# EAGLE design Home_automation (EAGLE 9.6.2)
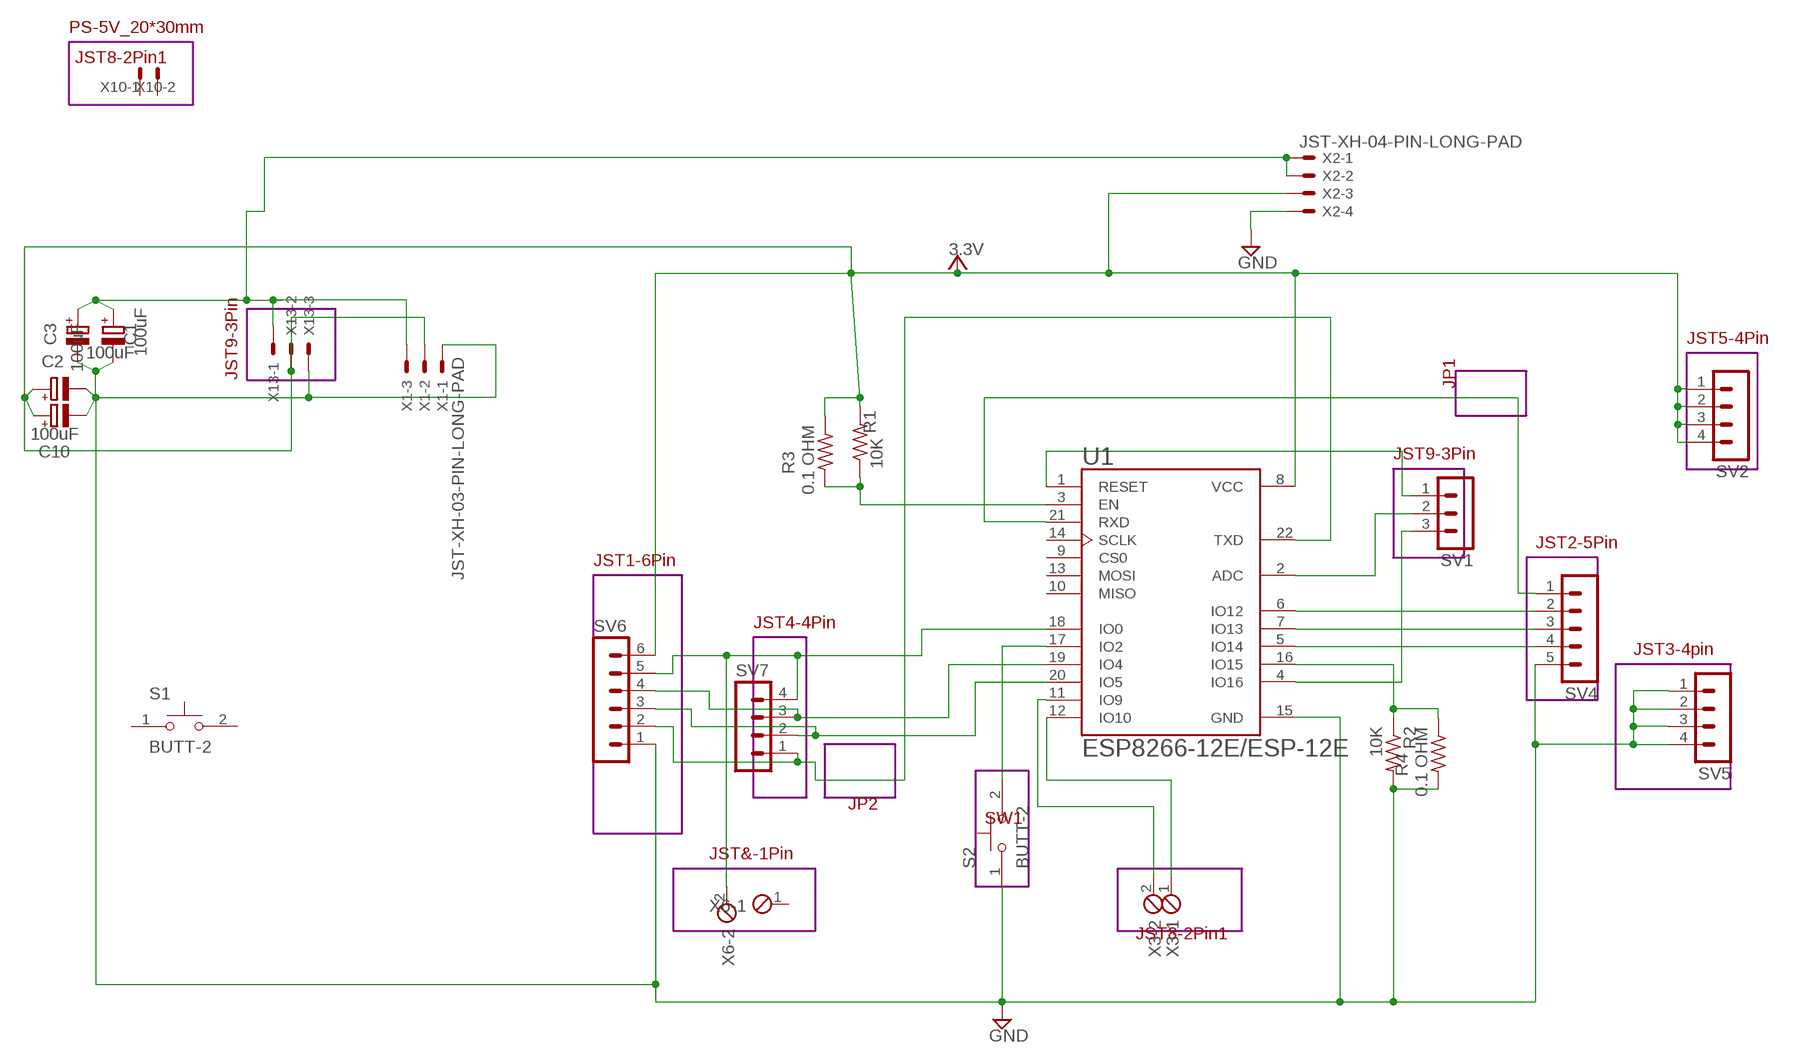
[diagram p0: schematic, sheet 1]

## Parts
C1  100uF  CPOL-EUSMCB  [SMC_B]
C2  100uF  CPOL-EUE2,5-6E  [E2,5-6E]
C3  100uF  CPOL-EUE2,5-6E  [E2,5-6E]
C10  100uF  CPOL-EUSMCB  [SMC_B]
R1  10K  R-US_R0805  [R0805]
R2  10K  R-US_R0805  [R0805]
R3  0.1 OHM  R-US_0207/10  [0207/10]
R4  0.1 OHM  R-US_0207/10  [0207/10]
S1  BUTT-2  [SW_BUTT-2]
S2  BUTT-2  [SW_BUTT-2]
SV1  MA03-1  [MA03-1]
SV2  MA04-1  [MA04-1]
SV4  MA05-1  [MA05-1]
SV5  MA04-1  [MA04-1]
SV6  MA06-1  [MA06-1]
SV7  MA04-1  [MA04-1]
U1  ESP8266-12E/ESP-12E  [XCVR_ESP8266-12E/ESP-12E]
X1  JST-XH-03-PIN-LONG-PAD  [JST-XH-03-PACKAGE-LONG-PAD]
X2  JST-XH-04-PIN-LONG-PAD  [JST-XH-04-PACKAGE-LONG-PAD]
X3  MPT2  [2POL254]
X6  MPT2  [2POL254]
X10  JST-XH-02-PIN-LONG-PAD  [JST-XH-02-PACKAGE-LONG-PAD]
X13  JST9-3Pin  JST-XH-03-PIN-LONG-PAD  [JST-XH-03-PACKAGE-LONG-PAD]

## Nets
GND: C1.- C2.- C3.- C10.- R2.2 R4.2 S2.1 SV4.5 SV5.1 SV5.2 SV5.3 SV5.4 SV6.1 U1.15(GND) X1.1 X2.4 X13.3
N$1: SV4.3 U1.7(IO13)
N$2: SV4.2 U1.6(IO12)
N$3: SV4.4 U1.5(IO14)
N$4: SV4.1 U1.21(RXD)
N$7: R1.1 R3.2 U1.3(EN)
N$9: SV6.2 SV7.1 U1.22(TXD)
N$10: C1.+ C3.+ X1.3 X2.1 X2.2 X13.1
N$11: SV6.3 SV7.2 U1.20(IO5)
N$12: SV6.4 SV7.3 U1.19(IO4)
N$13: SV6.5 SV7.4 U1.18(IO0) X6.2
N$14: R2.1 R4.1 U1.16(IO15)
N$15: S2.2 U1.17(IO2)
N$16: U1.12(IO10) X3.1
N$17: U1.11(IO9) X3.2
N$18: SV1.1 U1.1(RESET)
N$19: SV1.2 U1.2(ADC)
N$20: SV1.3 U1.4(IO16)
VCC: C2.+ C10.+ R1.2 R3.1 SV2.1 SV2.2 SV2.3 SV2.4 SV6.6 U1.8(VCC) X1.2 X2.3 X13.2 ; supply symbol labelled 3.3V
Unconnected: S1.1 S1.2 U1.9(CS0) U1.10(MISO) U1.13(MOSI) U1.14(SCLK) X6.1 X10.1 X10.2

## Notes on the sheet
- PS-5V_20*30mm
- JST8-2Pin1
- JST5-4Pin
- JST9-3Pin
- JP1
- JST9-3Pin
- JST2-5Pin
- JST1-6Pin
- JST4-4Pin
- JST3-4pin
- JP2
- SW1
- JST&-1Pin
- JST8-2Pin1

## Library data of the parts
C1-C3 C10 = rcl:CPOL-EU: POLARIZED CAPACITOR, European symbol; SPICEPREFIX: C
R1-R4 = rcl:R-US_: RESISTOR, American symbol; SPICEPREFIX: R
S1 = BUTT-2_:BUTT-2: Tactile Switches MINI PUSH BUTTON SWITCH 2-PIN QTY. 4 Check prices <https://pricing.snapeda.com/parts/BUTT-2/Gravitech/view-part?ref=eda>; AVAILABILITY: Warning; DESCRIPTION: Tactile Switches MINI PUSH BUTTON SWITCH 2-PIN QTY. 4; MF: Gravitech; MP: BUTT-2; PACKAGE: None; PRICE: None; PURCHASE-URL: https://pricing.snapeda.com/search/part/BUTT-2/?ref=eda
S2 = BUTT-2:BUTT-2: Tactile Switches MINI PUSH BUTTON SWITCH 2-PIN QTY. 4 Check prices <https://pricing.snapeda.com/parts/BUTT-2/Gravitech/view-part?ref=eda>; AVAILABILITY: Warning; DESCRIPTION: Tactile Switches MINI PUSH BUTTON SWITCH 2-PIN QTY. 4; MF: Gravitech; MP: BUTT-2; PACKAGE: None; PRICE: None; PURCHASE-URL: https://pricing.snapeda.com/search/part/BUTT-2/?ref=eda
SV1 = con-lstb:MA03-1: PIN HEADER; OC_FARNELL: unknown; OC_NEWARK: unknown
SV2 SV5 SV7 = con-lstb:MA04-1: PIN HEADER; OC_FARNELL: unknown; OC_NEWARK: unknown
SV4 = con-lstb:MA05-1: PIN HEADER; OC_FARNELL: unknown; OC_NEWARK: unknown
SV6 = con-lstb:MA06-1: PIN HEADER; OC_FARNELL: unknown; OC_NEWARK: unknown
U1 = ESP8266-12E_ESP-12E:ESP8266-12E/ESP-12E: ESP-12E WiFi Module; AVAILABILITY: Unavailable; DESCRIPTION: This WiFi module has a 32-bit MCU micro and clock speeds supporting 80 MHz or 160 MHz. Supports the RTOS and integrated Wi-Fi MAC/BB/RF/PA/LNA, and has an on-board antenna.; MF: AI-Thinker; MP: ESP8266-12E/ESP-12E; PACKAGE: None; PRICE: None
X1 X13 = Rembrandt Electronics - JST XH Connectors v1-0:JST-XH-03-PIN: JST XH Connector 2 Pin Wire to board connector. Pitch: 2,54 mm, (0.100") Number of pins: 3 Created by Rembrandt Electronics www.rembrandtelectronics.com
X2 = Rembrandt Electronics - JST XH Connectors v1-0:JST-XH-04-PIN: JST XH Connector 2 Pin Wire to board connector. Pitch: 2,54 mm, (0.100") Number of pins: 4 Created by Rembrandt Electronics www.rembrandtelectronics.com
X3 X6 = con-phoenix-254:MPT2: PHOENIX CONNECTOR; OC_FARNELL: unknown; OC_NEWARK: unknown
X10 = Rembrandt Electronics - JST XH Connectors v1-0:JST-XH-02-PIN: JST XH Connector 2 Pin Wire to board connector. Pitch: 2,54 mm, (0.100") Number of pins: 2 Created by Rembrandt Electronics www.rembrandtelectronics.com

## Board
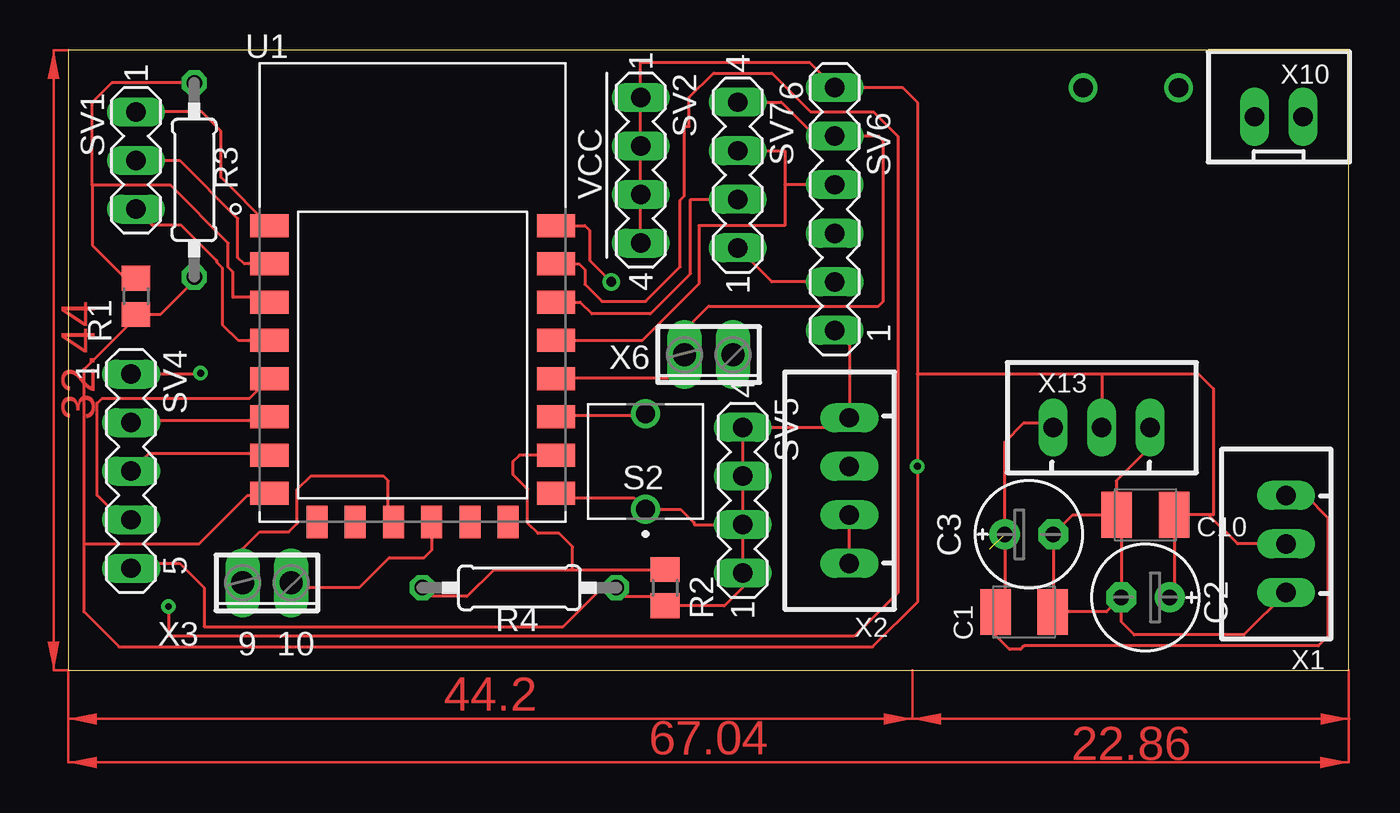
[diagram p1: board, top side]
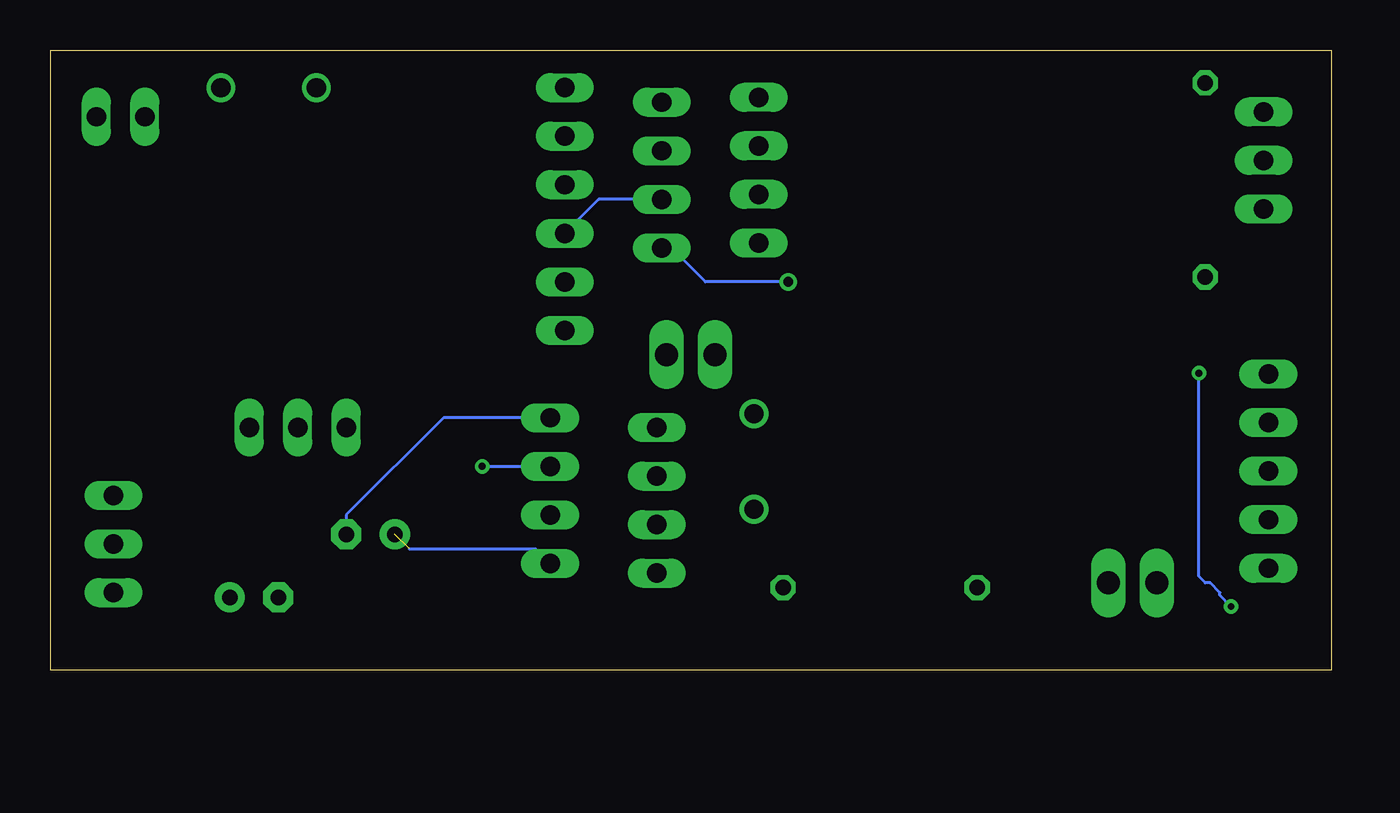
[diagram p2: board, bottom side, seen from below]

Size 67.04 x 32.44 mm. Coordinates in mm from the lower left corner, seen from the top.
Outline: 0,0 67.04,0 67.04,32.44 0,32.44 0,0
Copper layers (1*16): Top 0.035mm / dielectric 1.5mm / Bottom 0.035mm
Design rules "default": minimum track width 6mil, minimum drill 0.35mm, track to track 6mil, track to pad 6mil, pad to pad 6mil, via to via 6mil, smd to smd 6mil, copper to edge 40mil, drill to drill 6mil, minimum pad ring 10mil, minimum via ring 8mil, stop-mask expansion 4mil, vias tented up to drill 0mil, thermal gap 10mil

### Footprints (pad centres in the part's own frame; a part is rotated, then mirrored left to right if it is on the bottom)
SMC_B = smd 1.6 x 2.4: + -1.5,0; - 1.5,0
E2,5-6E = drill 0.813 pad 1.575: + -1.27,0 | drill 0.813 pad 1.575 octagon: - 1.27,0
R0805 = smd 1.3 x 1.5: 1 -0.95,0; 2 0.95,0
0207/10 = drill 0.813 octagon: 1 -5.08,0; 2 5.08,0
SW_BUTT-2 = drill 1: 1 -2.5,0; 2 2.5,0
MA03-1 = drill 1.016 long: 1 -2.54,0; 2 0,0; 3 2.54,0
MA04-1 = drill 1.016 long: 1 -3.81,0; 2 -1.27,0; 3 1.27,0; 4 3.81,0
MA05-1 = drill 1.016 long: 1 -5.08,0; 2 -2.54,0; 3 0,0; 4 2.54,0; 5 5.08,0
MA06-1 = drill 1.016 long: 1 -6.35,0; 2 -3.81,0; 3 -1.27,0; 4 1.27,0; 5 3.81,0; 6 6.35,0
XCVR_ESP8266-12E/ESP-12E = smd 2 x 1.2: 1 -7.5,7; 2 -7.5,5; 3 -7.5,3; 4 -7.5,1; 5 -7.5,-1; 6 -7.5,-3; 7 -7.5,-5; 8 -7.5,-7; 15 7.5,-7; 16 7.5,-5; 17 7.5,-3; 18 7.5,-1; 19 7.5,1; 20 7.5,3; 21 7.5,5; 22 7.5,7 | smd 1.1 x 1.7: 9 -5,-8.5; 10 -3,-8.5; 11 -1,-8.5; 12 1,-8.5; 13 3,-8.5; 14 5,-8.5
JST-XH-03-PACKAGE-LONG-PAD = drill 1.016 long: 1 -2.54,0; 2 0,0; 3 2.54,0
JST-XH-04-PACKAGE-LONG-PAD = drill 1.016 long: 1 -3.81,0; 2 -1.27,0; 3 1.27,0; 4 3.81,0
2POL254 = drill 1.2 long: 1 -1.27,0; 2 1.27,0
JST-XH-02-PACKAGE-LONG-PAD = drill 1.016 long: 1 -1.27,0; 2 1.27,0

### Placement (x,y rotation side)
C1  50.04,3.05 0 top
C2  56.39,3.81 180 top
C3  50.29,7.11 0 top
C10  56.39,8.13 180 top
R1  3.56,19.56 270 top
R2  31.24,4.32 270 top
R3  6.6,25.65 90 top
R4  23.62,4.32 0 top
S1  55.63,30.48 0 top
S2  30.23,10.92 90 top
SV1  3.56,26.67 270 top
SV2  29.97,26.16 270 top
SV4  3.3,10.41 270 top
SV5  35.31,8.89 90 top
SV6  40.13,24.13 90 top
SV7  35.05,25.91 90 top
U1  18.03,16.26 0 top
X1  63.75,6.6 90 top
X2  40.89,9.4 90 top
X3  10.41,4.57 180 top
X6  33.53,16.51 180 top
X10  63.37,28.96 0 top
X13  54.1,12.7 0 top

### Tracks (layer width: path | path; a pad name or v marks a point on that pad's centre or on a via)
GND
  Top 0.152: R2.2 31.24,3.86 29.16,3.86 R4.2 | 25.6,9.2 U1.15 25.79,9 29.65,9 S2.1 | 28.6,4.37 R4.2 | 31.24,3.5 R2.2 | 3.3,5.44 SV4.5 3.56,5.59 5.84,5.59 7.11,4.32 7.11,2.29 25.91,2.29 27.94,4.32 R4.2 | 30.23,8.53 S2.1 | SV5.2 SV5.3 SV5.4 40.39,12.7 X2.4 40.89,17.02 SV6.1 | S2.1 32.07,8.42 32.77,7.72 32.77,7.62 SV5.2 | X13.3 56.64,11.68 54.86,9.91 54.86,8.15 C10.- | C10.- 55.12,7.9 C2.- | C2.- 54.36,3.05 C1.- 51.56,3.07 C3.- 52.58,8.13 C10.- | X1.1 61.54,1.85 55.8,1.85 55.12,2.54 C2.- | SV5.2 SV5.1 35.31,4.32 34.36,3.37 R2.2
  Bottom 0.152: X2.4 46.48,13.21 51.56,8.13 C3.-
N$1
  Top 0.152: SV4.3 4.22,11.33 10.46,11.33 U1.7
N$2
  Top 0.152: U1.6 10.33,13.06 3.4,13.06 SV4.2
N$3
  Top 0.152: SV4.4 2.79,7.87 1.52,9.14 1.52,13.97 1.78,14.22 3.81,14.22 4.06,14.22 9.5,14.22 U1.5
N$4  (via drill 0.35)
  Top 0.152: v5.26,3.33 5.26,1.78 41.15,1.78 43.43,4.06 43.43,27.94 42.16,29.21 38.86,29.21 36.83,31.24 33.78,31.24 32.51,29.97 32.51,28.45 32.26,28.45 32.26,24.82 32.03,24.59 32.03,21.11 30.23,19.3 27.94,19.3 27.05,20.19 27.05,20.95 26.75,21.26 U1.21 | SV4.1 6.99,15.49 v6.94,15.54
  Bottom 0.152: v5.26,3.33 5.84,3.92 5.84,4.06 6.35,4.57 6.6,4.57 6.94,4.9 v6.94,15.54
N$7
  Top 0.152: 6.71,30.68 R3.2 2.29,30.73 1.27,29.72 1.27,25.37 1.3,25.37 | 10.67,19.41 U1.3 | U1.3 10.66,19.26 10.67,19.25 | 1.3,25.37 1.3,22.2 2.98,20.51 R1.1 | 1.3,25.37 5.36,25.37 8.38,22.35 8.38,21.08 8.64,20.83 8.64,19.51 10.28,19.51 U1.3
N$9  (via drill 0.51)
  Top 0.152: SV6.2 36.83,20.32 SV7.1 | v28.43,20.32 27.31,21.43 27.31,23 27.06,23.26 U1.22 25.39,23.11
  Bottom 0.152: v28.43,20.32 32.77,20.32 34.54,22.1 SV7.1
N$10  (1 unrouted)
  Top 0.152: X13.1 51.31,12.95 50.04,12.95 49.02,11.94 C3.+ 49.02,3.53 C1.+ 48.54,1.83 49.28,1.09 49.86,1.09 50.04,1.27 65.44,1.27 65.94,1.78 65.94,7.97 64.77,9.14 X1.3 | X2.1 X2.2
  Bottom 0.152: X2.1 41.66,6.35 48.26,6.35
N$11
  Top 0.152: SV7.2 32.59,24.64 32.59,20.75 30.48,18.64 27.42,18.64 26.8,19.26 U1.20 25.53,19.18 25.15,18.8
  Bottom 0.152: SV7.2 38.35,24.64 SV6.3
N$12
  Top 0.152: SV7.3 37.52,27.18 37.52,25.4 | SV6.4 37.52,25.4 | 37.52,25.4 37.52,23.27 33.02,23.27 33.02,20.22 30.07,17.27 25.55,17.27 U1.19
N$13
  Top 0.152: U1.18 25.6,15.29 31.8,15.29 32.26,15.75 X6.2 | 34.95,29.77 SV7.4 37.34,29.72 39.12,27.94 SV6.5 42.42,27.94 42.67,27.69 42.67,19.3 42.42,19.05 33.53,19.05 32.26,17.78 X6.2 | X6.2 32.51,16.26 32.77,16.26
N$14
  Top 0.152: 31.24,5.84 R2.1 26.42,5.27 | R4.1 18.54,3.86 20.88,3.86 22.29,5.27 26.42,5.27 | 23.88,11.26 U1.16 23.62,11.26 23.29,10.92 23.29,10.24 24.05,9.48 24.05,7.7 24.59,7.16 25.7,7.16 26.42,6.45 26.42,5.27
N$15
  Top 0.152: U1.17 25.6,13.31 30.11,13.31 S2.2
N$16
  Top 0.152: U1.12 19.03,6.28 18.64,5.89 16.82,5.89 15.24,4.32 11.94,4.32 X3.1
N$17
  Top 0.152: 16.92,7.67 U1.11 16.76,8.03 16.76,9.91 16.51,10.16 12.7,10.16 12,9.46 12,7.68 11.56,7.24 10.03,7.24 9.14,6.35 X3.2
N$18
  Top 0.152: U1.1 8.01,25.79 8.01,28.19 6.99,29.21 SV1.1
N$19
  Top 0.152: SV1.2 5.84,26.67 8.89,23.62 8.89,21.59 9.22,21.26 U1.2
N$20
  Top 0.152: U1.4 8.91,17.26 8.08,18.09 8.08,18.8 8.08,21.04 7.79,21.34 7.79,21.43 5.93,23.28 4.41,23.28 SV1.3
VCC  (via drill 0.35)
  Top 0.152: U1.8 10.42,9.14 9.4,9.14 6.86,6.6 0.84,6.6 | 0.84,6.6 0.84,3.05 2.67,1.22 42.11,1.22 44.45,3.56 v44.45,10.67 44.45,15.49 | R3.1 6.6,20.39 4.83,18.61 R1.2 3.56,18.47 0.84,15.75 0.84,6.6 | 57.66,8.38 58.17,8.89 58.17,8.64 | 58.17,8.64 58.17,8.41 C10.+ 57.89,4.04 C2.+ | 44.45,15.49 44.45,29.72 43.69,30.48 SV6.6 38.81,31.8 29.97,31.8 SV2.1 SV2.2 SV2.3 SV2.4 | 59.69,8.13 59.94,8.13 59.94,14.73 59.18,15.49 54.1,15.49 | 59.69,8.13 58.67,8.13 58.17,8.64 | 54.1,15.49 44.45,15.49 | X1.2 61.21,6.6 59.69,8.13 | 54.1,15.49 X13.2
  Bottom 0.152: v44.45,10.67 X2.3
(copper drawn outside any net)
  shapes: Top area x4

### Text on the board
tNames: VCC | 9 | 10